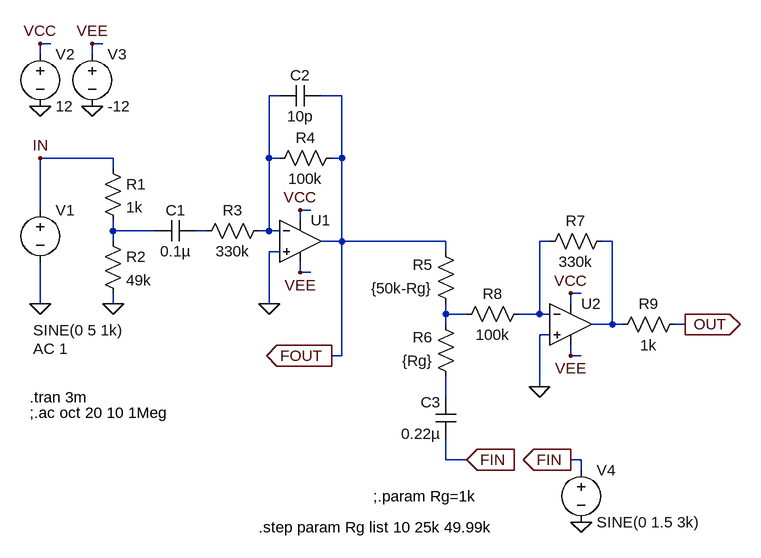
[diagram p0: schematic FX-1_Interface.asc]
FX-1_Interface.asc, the LTspice schematic file:
Version 4
SHEET 1 968 680
WIRE -192 -176 -208 -176
WIRE -112 -176 -128 -176
WIRE -208 -160 -208 -176
WIRE -128 -160 -128 -176
WIRE 160 -96 144 -96
WIRE 256 -96 224 -96
WIRE -96 0 -208 0
WIRE 144 0 144 -96
WIRE 160 0 144 0
WIRE 256 0 256 -96
WIRE 256 0 240 0
WIRE -96 16 -96 0
WIRE -208 80 -208 0
WIRE 208 80 192 80
WIRE 192 96 192 80
WIRE -96 112 -96 96
WIRE -32 112 -96 112
WIRE 48 112 32 112
WIRE 144 112 144 0
WIRE 144 112 128 112
WIRE 160 112 144 112
WIRE -96 128 -96 112
WIRE 256 128 256 0
WIRE 256 128 224 128
WIRE 416 128 256 128
WIRE 576 128 560 128
WIRE 672 128 656 128
WIRE 160 144 144 144
WIRE 416 144 416 128
WIRE 192 176 192 160
WIRE 208 176 192 176
WIRE 624 208 608 208
WIRE -208 224 -208 160
WIRE -96 224 -96 208
WIRE 144 224 144 144
WIRE 608 224 608 208
WIRE 416 240 416 224
WIRE 448 240 416 240
WIRE 560 240 560 128
WIRE 560 240 528 240
WIRE 576 240 560 240
WIRE 416 256 416 240
WIRE 672 256 672 128
WIRE 672 256 640 256
WIRE 688 256 672 256
WIRE 784 256 768 256
WIRE 576 272 560 272
WIRE 256 304 256 128
WIRE 256 304 240 304
WIRE 608 304 608 288
WIRE 624 304 608 304
WIRE 560 352 560 272
WIRE 416 368 416 336
WIRE 416 464 416 432
WIRE 448 464 416 464
WIRE 624 464 608 464
WIRE 624 480 624 464
FLAG -208 224 0
FLAG -96 224 0
FLAG 192 80 VCC
FLAG 192 176 VEE
FLAG 144 224 0
FLAG 608 208 VCC
FLAG 608 304 VEE
FLAG 560 352 0
FLAG 240 304 FOUT
IOPIN 240 304 Out
FLAG 448 464 FIN
IOPIN 448 464 In
FLAG 784 256 OUT
IOPIN 784 256 Out
FLAG -208 0 IN
FLAG -208 -80 0
FLAG -128 -80 0
FLAG -208 -176 VCC
FLAG -128 -176 VEE
FLAG 608 464 FIN
IOPIN 608 464 Out
FLAG 624 560 0
SYMBOL Opamps\\UniversalOpamp2 192 128 R0
SYMATTR InstName U1
SYMBOL Opamps\\UniversalOpamp2 608 256 R0
SYMATTR InstName U2
SYMBOL res -112 0 R0
SYMATTR InstName R1
SYMATTR Value 1k
SYMBOL res -112 112 R0
SYMATTR InstName R2
SYMATTR Value 49k
SYMBOL cap 32 96 R90
WINDOW 0 0 32 VBottom 2
WINDOW 3 32 32 VTop 2
SYMATTR InstName C1
SYMATTR Value 0.1µ
SYMBOL res 144 96 R90
WINDOW 0 0 56 VBottom 2
WINDOW 3 32 56 VTop 2
SYMATTR InstName R3
SYMATTR Value 330k
SYMBOL res 256 -16 R90
WINDOW 0 0 56 VBottom 2
WINDOW 3 32 56 VTop 2
SYMATTR InstName R4
SYMATTR Value 100k
SYMBOL cap 224 -112 R90
WINDOW 0 0 32 VBottom 2
WINDOW 3 32 32 VTop 2
SYMATTR InstName C2
SYMATTR Value 10p
SYMBOL res 432 240 R180
WINDOW 0 36 76 Left 2
WINDOW 3 36 40 Left 2
SYMATTR InstName R5
SYMATTR Value {50k-Rg}
SYMBOL res 432 352 R180
WINDOW 0 36 76 Left 2
WINDOW 3 36 40 Left 2
SYMATTR InstName R6
SYMATTR Value {Rg}
SYMBOL res 672 112 R90
WINDOW 0 0 56 VBottom 2
WINDOW 3 32 56 VTop 2
SYMATTR InstName R7
SYMATTR Value 330k
SYMBOL cap 432 432 R180
WINDOW 0 24 56 Left 2
WINDOW 3 24 8 Left 2
SYMATTR InstName C3
SYMATTR Value 0.22µ
SYMBOL voltage -208 64 R0
WINDOW 3 -11 201 Left 2
WINDOW 123 -11 229 Left 2
WINDOW 39 0 0 Left 0
SYMATTR Value SINE(0 5 1k)
SYMATTR Value2 AC 1
SYMATTR InstName V1
SYMBOL voltage -208 -176 R0
WINDOW 123 0 0 Left 0
WINDOW 39 0 0 Left 0
SYMATTR InstName V2
SYMATTR Value 12
SYMBOL voltage -128 -176 R0
WINDOW 123 0 0 Left 0
WINDOW 39 0 0 Left 0
SYMATTR InstName V3
SYMATTR Value -12
SYMBOL voltage 624 464 R0
WINDOW 123 24 124 Left 2
WINDOW 39 0 0 Left 0
SYMATTR InstName V4
SYMATTR Value SINE(0 1.5 3k)
SYMBOL res 784 240 R90
WINDOW 0 0 56 VBottom 2
WINDOW 3 32 56 VTop 2
SYMATTR InstName R9
SYMATTR Value 1k
SYMBOL res 544 224 R90
WINDOW 0 0 56 VBottom 2
WINDOW 3 32 56 VTop 2
SYMATTR InstName R8
SYMATTR Value 100k
TEXT -224 368 Left 2 !.tran 3m
TEXT -224 392 Left 2 !;.ac oct 20 10 1Meg
TEXT 304 520 Left 2 !;.param Rg=1k
TEXT 128 568 Left 2 !.step param Rg list 10 25k 49.99k

The netlist it stands for:
* FX-1_Interface.asc
XU1 0 N001 VCC VEE FOUT level.2 Avol=1Meg GBW=10Meg Slew=10Meg ilimit=25m rail=0 Vos=0 phimargin=45 en=0 enk=0 in=0 ink=0 Rin=500Meg  ; pins IN+ IN- V+ V- OUT
XU2 0 N004 VCC VEE N005 level.2 Avol=1Meg GBW=10Meg Slew=10Meg ilimit=25m rail=0 Vos=0 phimargin=45 en=0 enk=0 in=0 ink=0 Rin=500Meg  ; pins IN+ IN- V+ V- OUT
R1 IN N002 1k
R2 N002 0 49k
C1 N003 N002 0.1µ
R3 N001 N003 330k
R4 FOUT N001 100k
C2 FOUT N001 10p
R5 N006 FOUT {50k-Rg}
R6 N007 N006 {Rg}
R7 N005 N004 330k
C3 FIN N007 0.22µ
V1 IN 0 SINE(0 5 1k) AC 1
V2 VCC 0 12
V3 VEE 0 -12
V4 FIN 0 SINE(0 1.5 3k)
R9 OUT N005 1k
R8 N004 N006 100k
.tran 3m
;.ac oct 20 10 1Meg
;.param Rg=1k
.step param Rg list 10 25k 49.99k
.lib UniversalOpamps2.sub
.backanno
.end